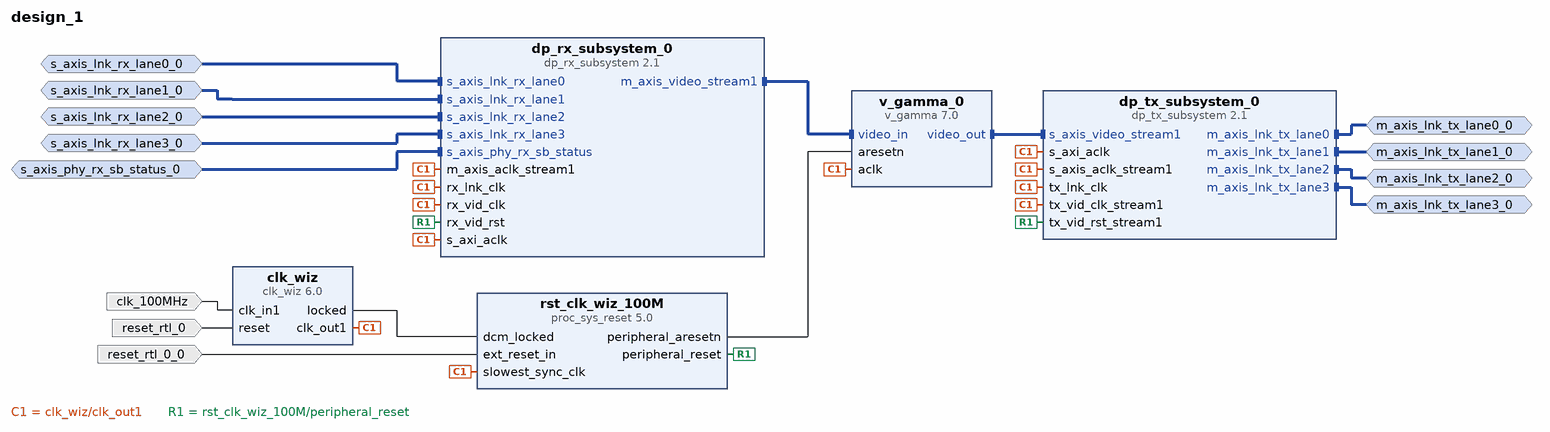
[diagram p0: block diagram of the top level]
# Vivado block design design_1, xc7vx485tffg1157-1, Vivado 2018.1
create_bd_design design_1

create_bd_intf_port -mode Master -vlnv xilinx.com:interface:axis_rtl:1.0 m_axis_lnk_tx_lane0_0
create_bd_intf_port -mode Master -vlnv xilinx.com:interface:axis_rtl:1.0 m_axis_lnk_tx_lane1_0
create_bd_intf_port -mode Master -vlnv xilinx.com:interface:axis_rtl:1.0 m_axis_lnk_tx_lane2_0
create_bd_intf_port -mode Master -vlnv xilinx.com:interface:axis_rtl:1.0 m_axis_lnk_tx_lane3_0
create_bd_intf_port -mode Slave -vlnv xilinx.com:interface:axis_rtl:1.0 s_axis_lnk_rx_lane0_0
set_property -dict [list \
  CONFIG.TDATA_NUM_BYTES 4 \
  CONFIG.TDEST_WIDTH 0 \
  CONFIG.TID_WIDTH 0 \
  CONFIG.TUSER_WIDTH 12 \
  CONFIG.HAS_TREADY 1 \
  CONFIG.HAS_TSTRB 0 \
  CONFIG.HAS_TKEEP 0 \
  CONFIG.HAS_TLAST 0 \
  CONFIG.LAYERED_METADATA undef \
] [get_bd_intf_ports s_axis_lnk_rx_lane0_0]
create_bd_intf_port -mode Slave -vlnv xilinx.com:interface:axis_rtl:1.0 s_axis_lnk_rx_lane1_0
set_property -dict [list \
  CONFIG.TDATA_NUM_BYTES 4 \
  CONFIG.TDEST_WIDTH 0 \
  CONFIG.TID_WIDTH 0 \
  CONFIG.TUSER_WIDTH 12 \
  CONFIG.HAS_TREADY 1 \
  CONFIG.HAS_TSTRB 0 \
  CONFIG.HAS_TKEEP 0 \
  CONFIG.HAS_TLAST 0 \
  CONFIG.LAYERED_METADATA undef \
] [get_bd_intf_ports s_axis_lnk_rx_lane1_0]
create_bd_intf_port -mode Slave -vlnv xilinx.com:interface:axis_rtl:1.0 s_axis_lnk_rx_lane2_0
set_property -dict [list \
  CONFIG.TDATA_NUM_BYTES 4 \
  CONFIG.TDEST_WIDTH 0 \
  CONFIG.TID_WIDTH 0 \
  CONFIG.TUSER_WIDTH 12 \
  CONFIG.HAS_TREADY 1 \
  CONFIG.HAS_TSTRB 0 \
  CONFIG.HAS_TKEEP 0 \
  CONFIG.HAS_TLAST 0 \
  CONFIG.LAYERED_METADATA undef \
] [get_bd_intf_ports s_axis_lnk_rx_lane2_0]
create_bd_intf_port -mode Slave -vlnv xilinx.com:interface:axis_rtl:1.0 s_axis_lnk_rx_lane3_0
set_property -dict [list \
  CONFIG.TDATA_NUM_BYTES 4 \
  CONFIG.TDEST_WIDTH 0 \
  CONFIG.TID_WIDTH 0 \
  CONFIG.TUSER_WIDTH 12 \
  CONFIG.HAS_TREADY 1 \
  CONFIG.HAS_TSTRB 0 \
  CONFIG.HAS_TKEEP 0 \
  CONFIG.HAS_TLAST 0 \
  CONFIG.LAYERED_METADATA undef \
] [get_bd_intf_ports s_axis_lnk_rx_lane3_0]
create_bd_intf_port -mode Slave -vlnv xilinx.com:interface:axis_rtl:1.0 s_axis_phy_rx_sb_status_0
set_property -dict [list \
  CONFIG.TDATA_NUM_BYTES 2 \
  CONFIG.TDEST_WIDTH 0 \
  CONFIG.TID_WIDTH 0 \
  CONFIG.TUSER_WIDTH 0 \
  CONFIG.HAS_TREADY 1 \
  CONFIG.HAS_TSTRB 0 \
  CONFIG.HAS_TKEEP 0 \
  CONFIG.HAS_TLAST 0 \
  CONFIG.LAYERED_METADATA undef \
] [get_bd_intf_ports s_axis_phy_rx_sb_status_0]
create_bd_port -dir I -type clk clk_100MHz
set_property -dict {CONFIG.FREQ_HZ 100000000} [get_bd_ports clk_100MHz]
create_bd_port -dir I -type rst reset_rtl_0_0
set_property -dict {CONFIG.POLARITY ACTIVE_LOW} [get_bd_ports reset_rtl_0_0]
create_bd_port -dir I -type rst reset_rtl_0
set_property -dict {CONFIG.POLARITY ACTIVE_HIGH} [get_bd_ports reset_rtl_0]

create_bd_cell -type ip -vlnv xilinx.com:ip:clk_wiz:6.0 clk_wiz
create_bd_cell -type ip -vlnv xilinx.com:ip:dp_rx_subsystem:2.1 dp_rx_subsystem_0
create_bd_cell -type ip -vlnv xilinx.com:ip:dp_tx_subsystem:2.1 dp_tx_subsystem_0
create_bd_cell -type ip -vlnv xilinx.com:ip:proc_sys_reset:5.0 rst_clk_wiz_100M
create_bd_cell -type ip -vlnv xilinx.com:ip:v_gamma:7.0 v_gamma_0

# ---- connections ----

connect_bd_intf_net [get_bd_intf_pins dp_rx_subsystem_0/m_axis_video_stream1] [get_bd_intf_pins v_gamma_0/video_in]
connect_bd_intf_net [get_bd_intf_pins dp_tx_subsystem_0/s_axis_video_stream1] [get_bd_intf_pins v_gamma_0/video_out]
connect_bd_intf_net [get_bd_intf_ports m_axis_lnk_tx_lane0_0] [get_bd_intf_pins dp_tx_subsystem_0/m_axis_lnk_tx_lane0]
connect_bd_intf_net [get_bd_intf_ports m_axis_lnk_tx_lane1_0] [get_bd_intf_pins dp_tx_subsystem_0/m_axis_lnk_tx_lane1]
connect_bd_intf_net [get_bd_intf_ports m_axis_lnk_tx_lane2_0] [get_bd_intf_pins dp_tx_subsystem_0/m_axis_lnk_tx_lane2]
connect_bd_intf_net [get_bd_intf_ports m_axis_lnk_tx_lane3_0] [get_bd_intf_pins dp_tx_subsystem_0/m_axis_lnk_tx_lane3]
connect_bd_intf_net -intf_net s_axis_lnk_rx_lane0_0_1 [get_bd_intf_ports s_axis_lnk_rx_lane0_0] [get_bd_intf_pins dp_rx_subsystem_0/s_axis_lnk_rx_lane0]
connect_bd_intf_net -intf_net s_axis_lnk_rx_lane1_0_1 [get_bd_intf_ports s_axis_lnk_rx_lane1_0] [get_bd_intf_pins dp_rx_subsystem_0/s_axis_lnk_rx_lane1]
connect_bd_intf_net -intf_net s_axis_lnk_rx_lane2_0_1 [get_bd_intf_ports s_axis_lnk_rx_lane2_0] [get_bd_intf_pins dp_rx_subsystem_0/s_axis_lnk_rx_lane2]
connect_bd_intf_net -intf_net s_axis_lnk_rx_lane3_0_1 [get_bd_intf_ports s_axis_lnk_rx_lane3_0] [get_bd_intf_pins dp_rx_subsystem_0/s_axis_lnk_rx_lane3]
connect_bd_intf_net -intf_net s_axis_phy_rx_sb_status_0_1 [get_bd_intf_ports s_axis_phy_rx_sb_status_0] [get_bd_intf_pins dp_rx_subsystem_0/s_axis_phy_rx_sb_status]
connect_bd_net [get_bd_ports clk_100MHz] [get_bd_pins clk_wiz/clk_in1]
connect_bd_net [get_bd_pins clk_wiz/clk_out1] \
  [get_bd_pins dp_rx_subsystem_0/m_axis_aclk_stream1] [get_bd_pins dp_rx_subsystem_0/rx_lnk_clk] \
  [get_bd_pins dp_rx_subsystem_0/rx_vid_clk] [get_bd_pins dp_rx_subsystem_0/s_axi_aclk] \
  [get_bd_pins dp_tx_subsystem_0/s_axi_aclk] [get_bd_pins dp_tx_subsystem_0/s_axis_aclk_stream1] \
  [get_bd_pins dp_tx_subsystem_0/tx_lnk_clk] [get_bd_pins dp_tx_subsystem_0/tx_vid_clk_stream1] \
  [get_bd_pins rst_clk_wiz_100M/slowest_sync_clk] [get_bd_pins v_gamma_0/aclk]
connect_bd_net [get_bd_pins clk_wiz/locked] [get_bd_pins rst_clk_wiz_100M/dcm_locked]
connect_bd_net -net reset_rtl_0_0_1 [get_bd_ports reset_rtl_0_0] [get_bd_pins rst_clk_wiz_100M/ext_reset_in]
connect_bd_net -net reset_rtl_0_1 [get_bd_ports reset_rtl_0] [get_bd_pins clk_wiz/reset]
connect_bd_net [get_bd_pins rst_clk_wiz_100M/peripheral_aresetn] [get_bd_pins v_gamma_0/aresetn]
connect_bd_net [get_bd_pins rst_clk_wiz_100M/peripheral_reset] \
  [get_bd_pins dp_rx_subsystem_0/rx_vid_rst] [get_bd_pins dp_tx_subsystem_0/tx_vid_rst_stream1]

validate_bd_design
save_bd_design
